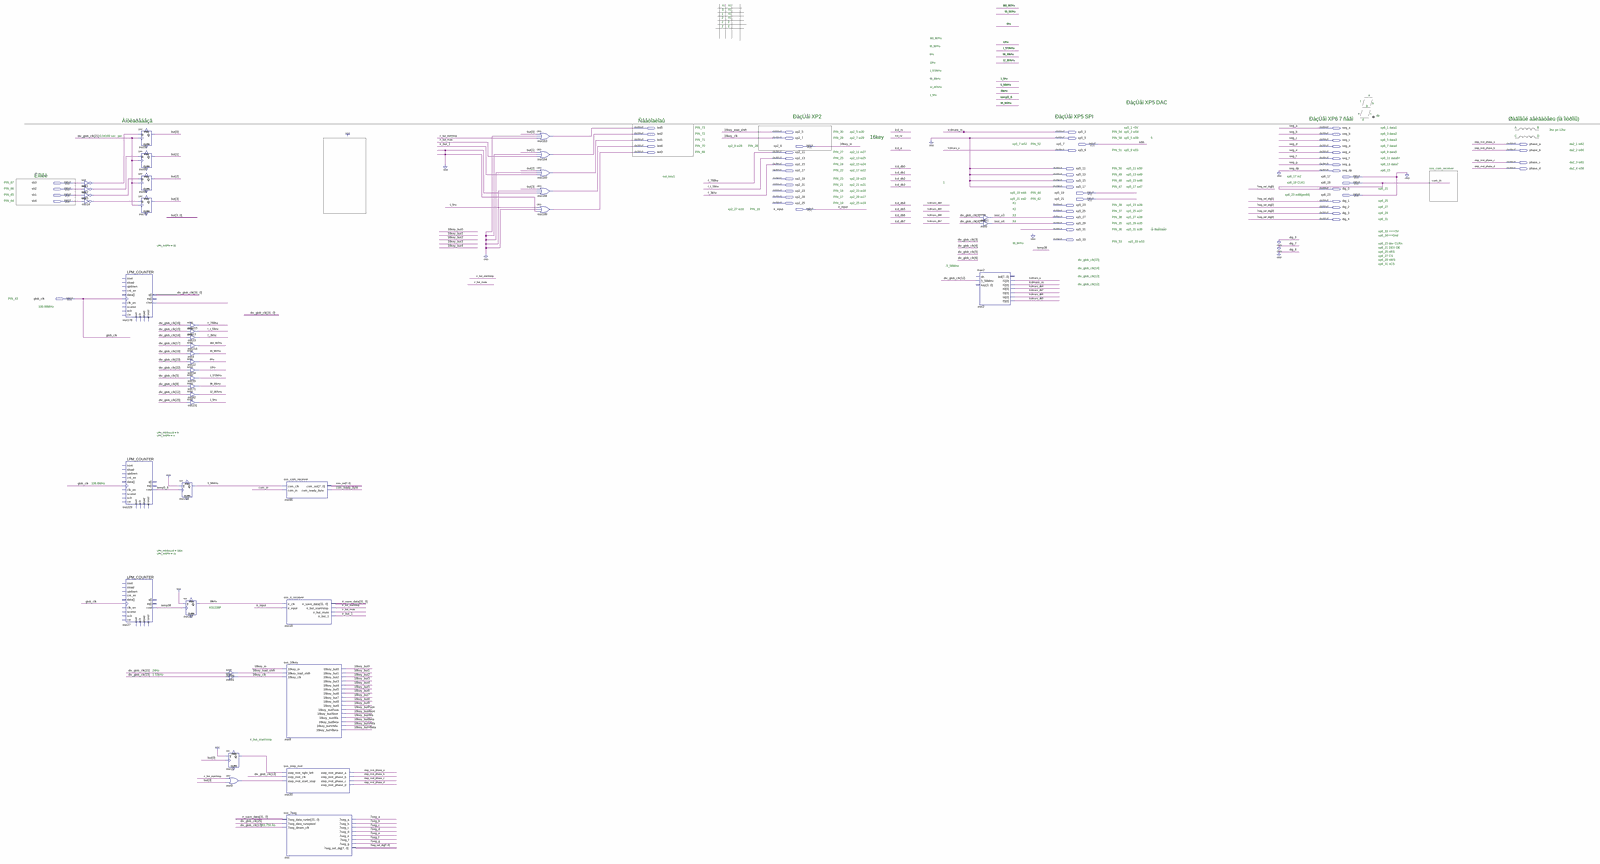
[diagram p0: schematic sheet, whole]
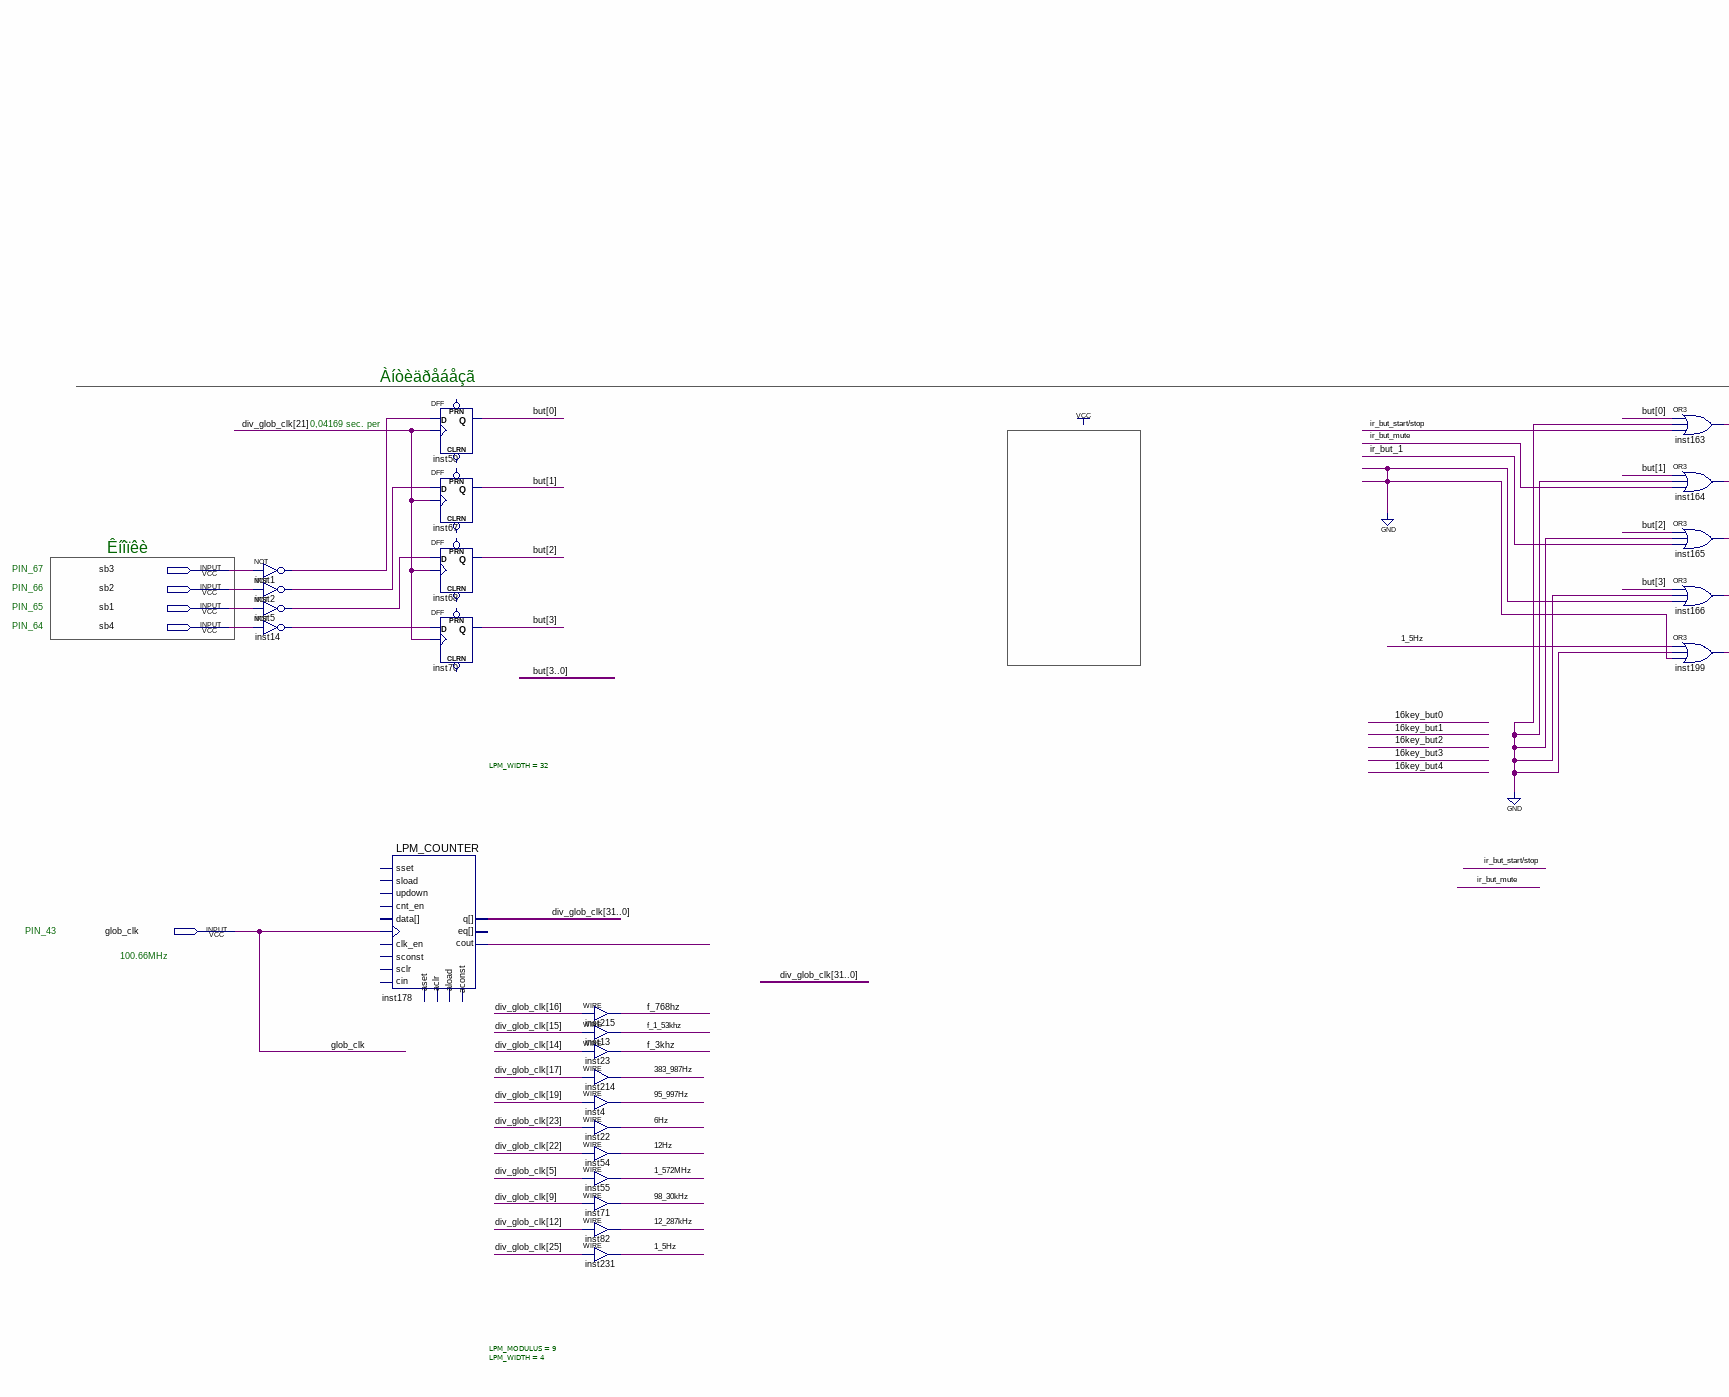
[diagram p1: schematic sheet, upper left part]
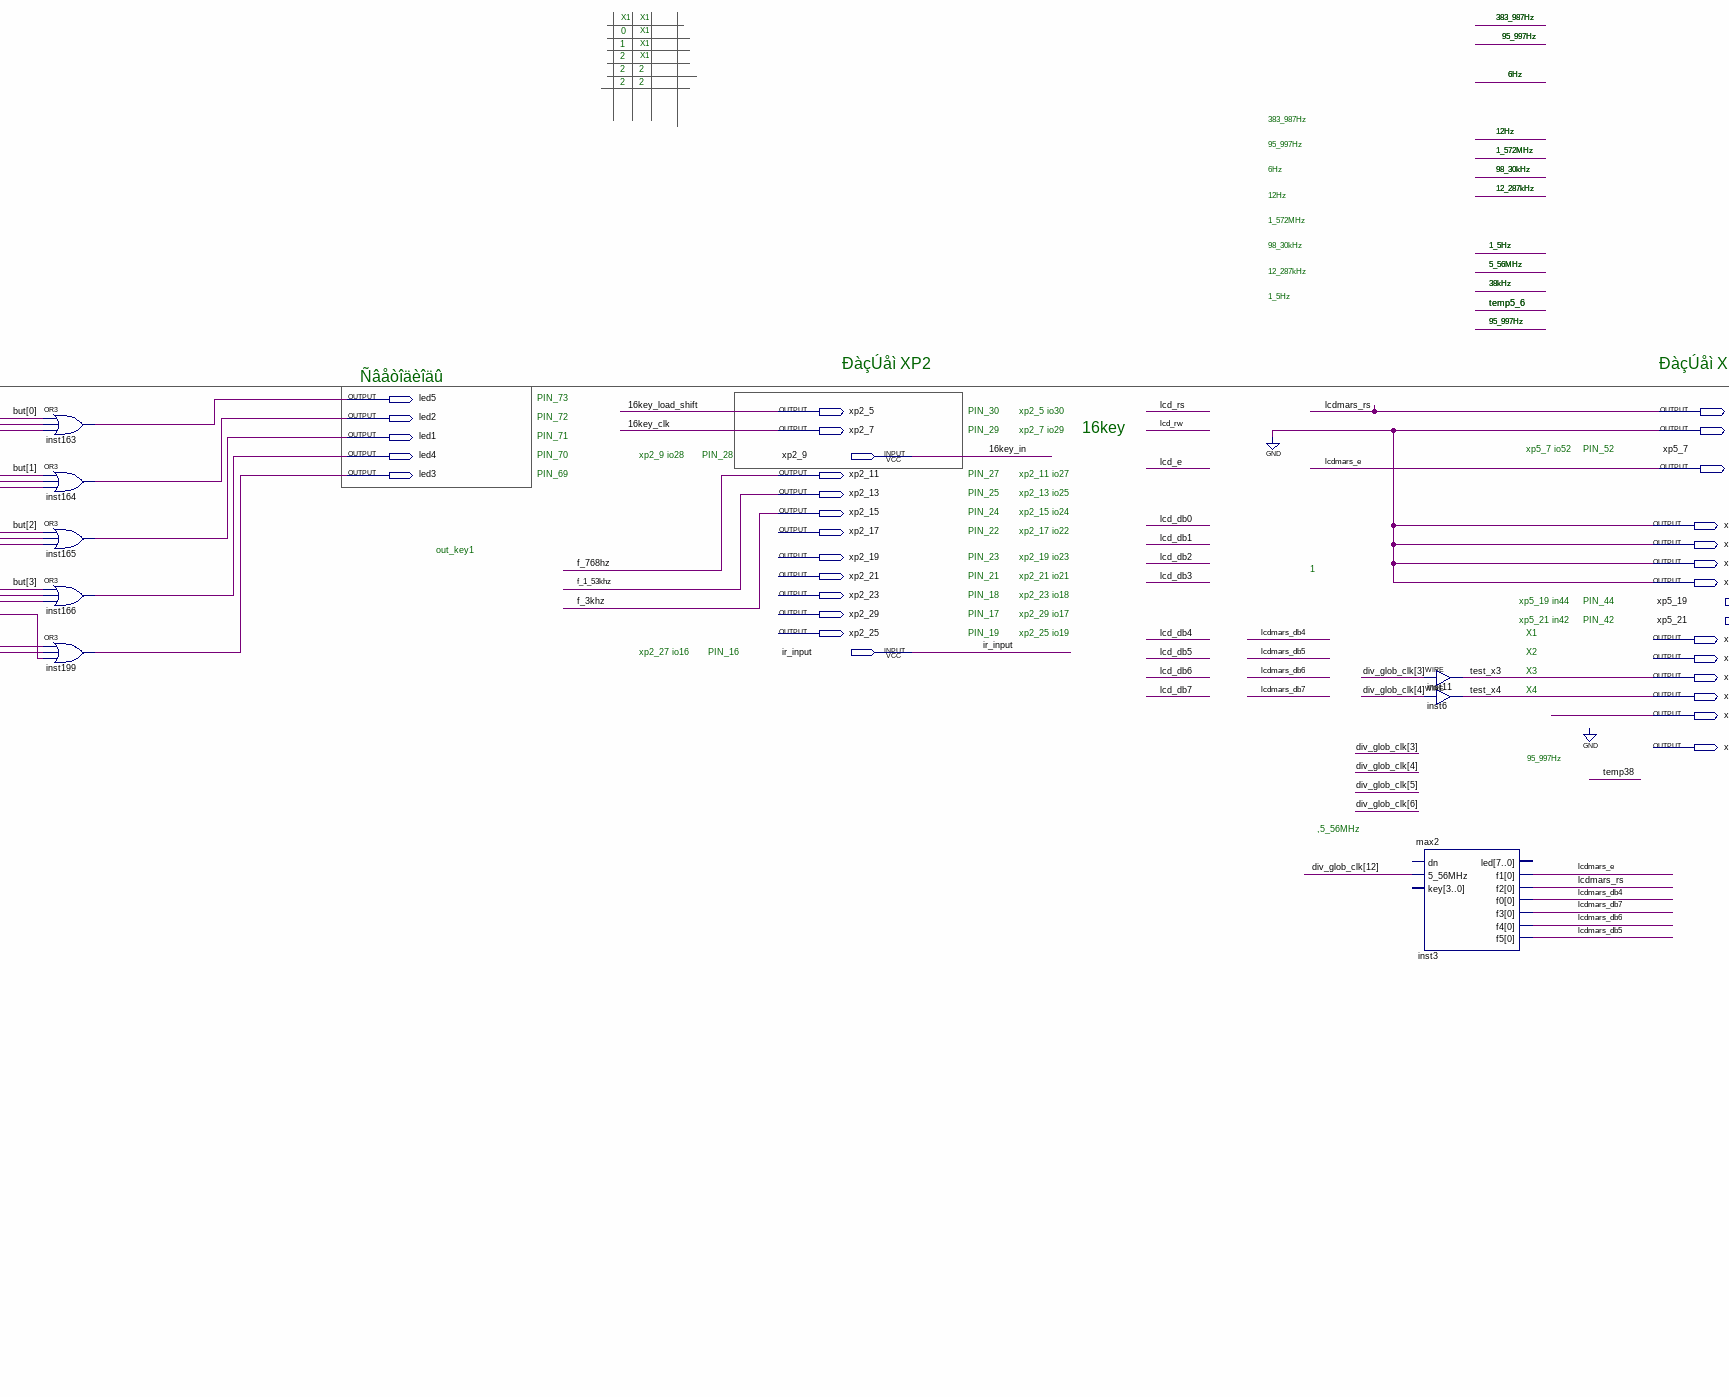
[diagram p2: schematic sheet, upper centre part]
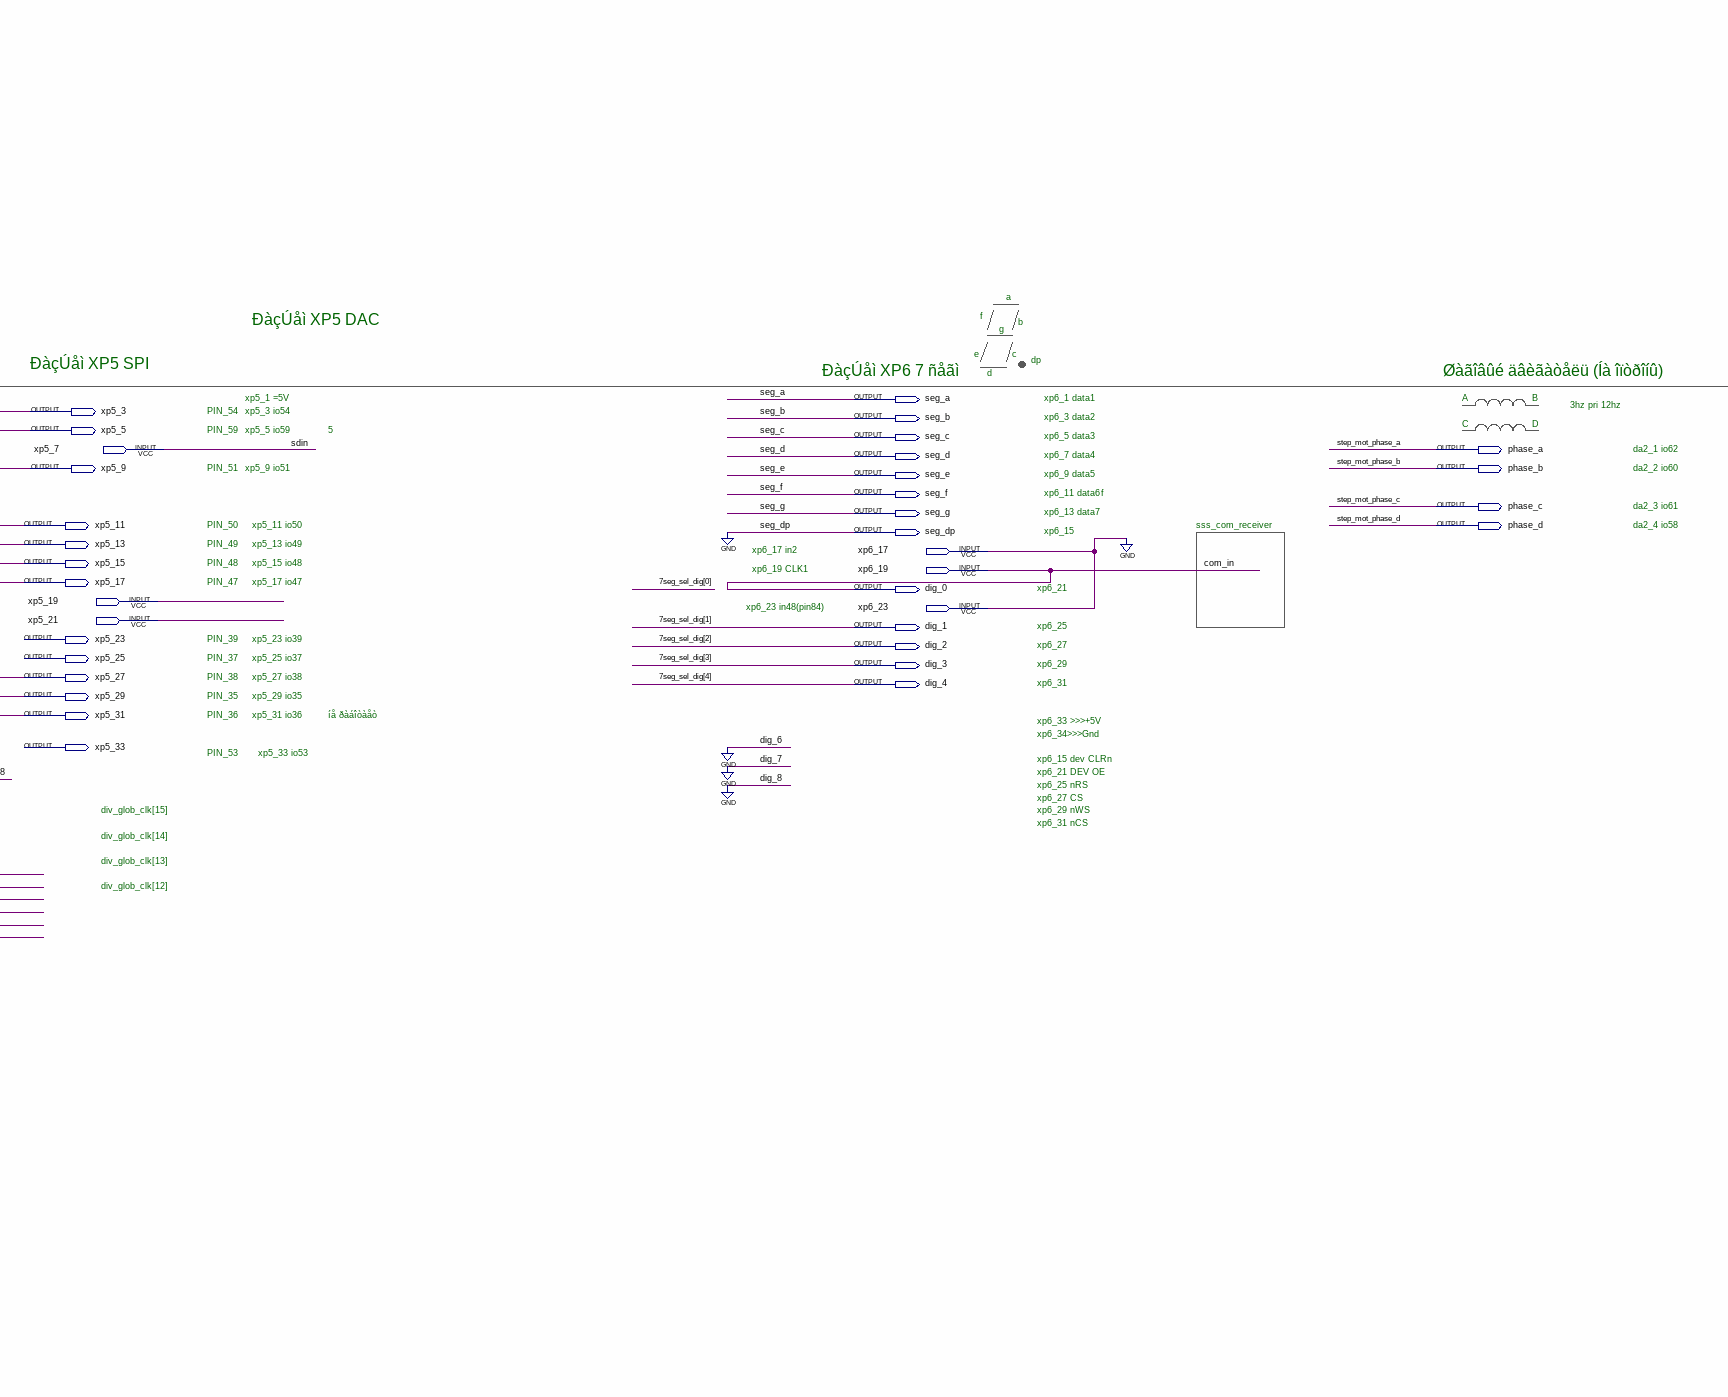
[diagram p3: schematic sheet, upper right part]
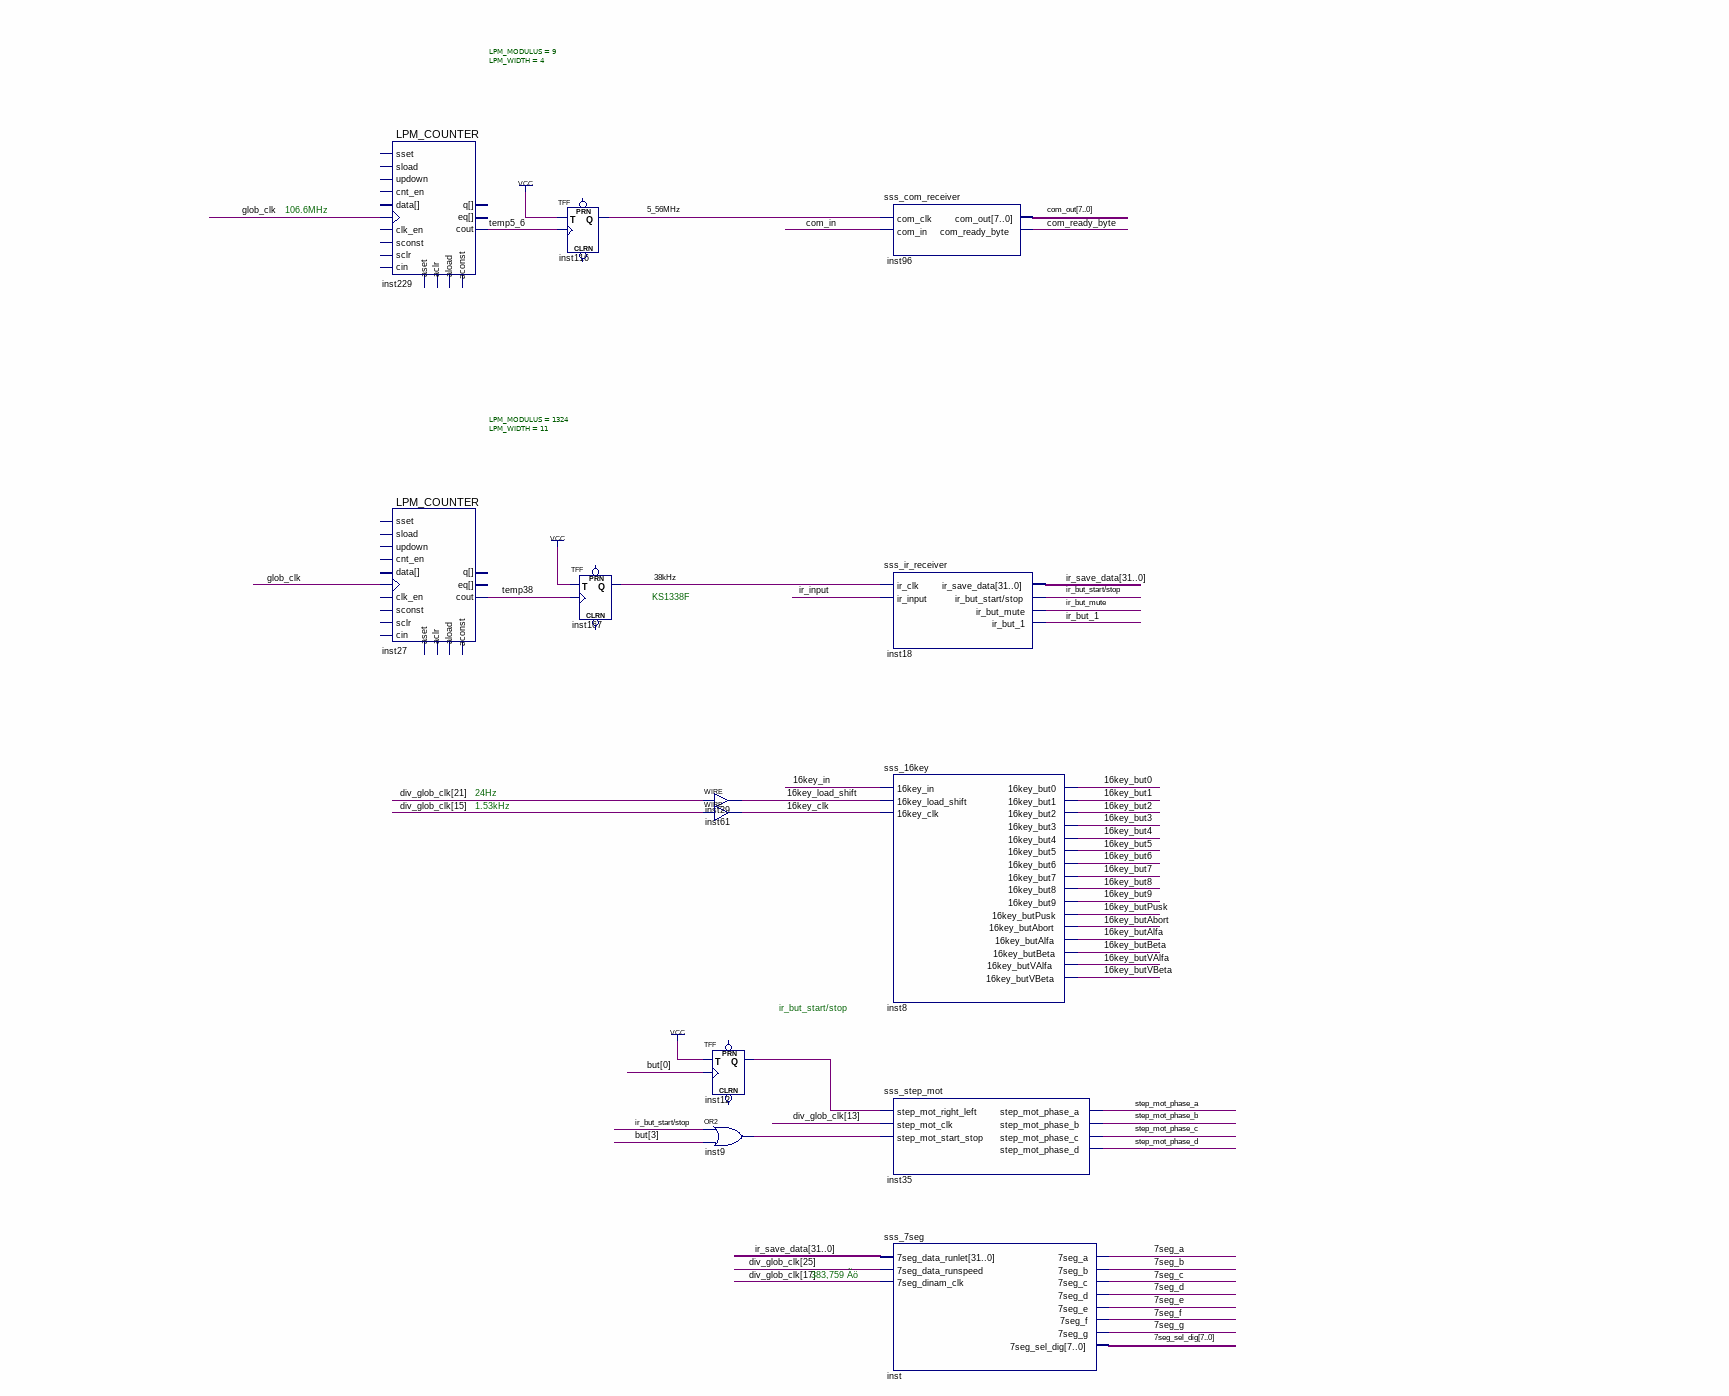
[diagram p4: schematic sheet, lower left part]
// Quartus schematic BRDepf10k10l.bdf as structural Verilog: 41 symbols, 59 pins
module BRDepf10k10l (
  input  xp5_7,
  input  xp2_9,
  input  xp6_17,
  input  sb3,
  input  xp6_19,
  input  sb2,
  input  xp5_19,
  input  sb1,
  input  xp6_23,
  input  xp5_21,
  input  sb4,
  input  ir_input,
  input  glob_clk,
  output led5,
  output seg_a,
  output xp2_5,
  output xp5_3,
  output led2,
  output seg_b,
  output xp2_7,
  output xp5_5,
  output led1,
  output seg_c,
  output phase_a,
  output led4,
  output seg_d,
  output xp5_9,
  output phase_b,
  output led3,
  output xp2_11,
  output seg_e,
  output xp2_13,
  output seg_f,
  output phase_c,
  output xp2_15,
  output seg_g,
  output xp5_11,
  output phase_d,
  output xp2_17,
  output seg_dp,
  output xp5_13,
  output xp2_19,
  output xp5_15,
  output xp2_21,
  output xp5_17,
  output dig_0,
  output xp2_23,
  output xp2_29,
  output dig_1,
  output xp2_25,
  output xp5_23,
  output dig_2,
  output xp5_25,
  output dig_3,
  output xp5_27,
  output dig_4,
  output xp5_29,
  output xp5_31,
  output xp5_33
);

  wire \1_5Hz , \1_572MHz , \5_56MHz , \6Hz , \7seg_a , \7seg_b , \7seg_c , \7seg_d , \7seg_e , \7seg_f ,
       \7seg_g , \12_287kHz , \12Hz , \16key_but0 , \16key_but1 , \16key_but2 , \16key_but3 , \16key_but4 ,
       \16key_but5 , \16key_but6 , \16key_but7 , \16key_but8 , \16key_but9 , \16key_butAbort ,
       \16key_butAlfa , \16key_butBeta , \16key_butPusk , \16key_butVAlfa , \16key_butVBeta , \38kHz ,
       \95_997Hz , \98_30kHz , \383_987Hz , com_ready_byte, inst1_out, inst2_out, inst5_out, inst9_out,
       inst12_q, inst14_out, inst178_cout, ir_but_1, ir_but_mute, \ir_but_start/stop , lcdmars_db4,
       lcdmars_db5, lcdmars_db6, lcdmars_db7, temp5_6, temp38;
  wire [3:0] but;
  wire [7:0] \7seg_sel_dig , com_out;
  wire [31:0] div_glob_clk, ir_save_data;

  not inst1 (inst1_out, sb3);
  not inst2 (inst2_out, sb2);
  not inst5 (inst5_out, sb1);
  not inst14 (inst14_out, sb4);
  LPM_COUNTER #(.LPM_WIDTH(32)) inst178 (
    .clock(glob_clk), .q(div_glob_clk), .cout(inst178_cout));  // open: sset, sload, updown, cnt_en, data, clk_en, sconst, sclr, aload, aclr, aset, aconst, cin, eq
  LPM_COUNTER #(.LPM_MODULUS(9), .LPM_WIDTH(4)) inst229 (
    .clock(glob_clk), .cout(temp5_6));  // open: sset, sload, updown, cnt_en, data, clk_en, sconst, sclr, aload, aclr, aset, aconst, cin, q, eq
  LPM_COUNTER #(.LPM_MODULUS(1324), .LPM_WIDTH(11)) inst27 (
    .clock(glob_clk), .cout(temp38));  // open: sset, sload, updown, cnt_en, data, clk_en, sconst, sclr, aload, aclr, aset, aconst, cin, q, eq
  DFF inst50 (.CLK(div_glob_clk[21]), .D(inst1_out), .Q(but[0]));  // open: CLRN, PRN
  DFF inst67 (.CLK(div_glob_clk[21]), .D(inst2_out), .Q(but[1]));  // open: CLRN, PRN
  DFF inst68 (.CLK(div_glob_clk[21]), .D(inst5_out), .Q(but[2]));  // open: CLRN, PRN
  DFF inst70 (.CLK(div_glob_clk[21]), .D(inst14_out), .Q(but[3]));  // open: CLRN, PRN
  assign xp2_11 = div_glob_clk[16];  // WIRE inst215
  assign xp2_13 = div_glob_clk[15];  // WIRE inst13
  assign xp2_15 = div_glob_clk[14];  // WIRE inst23
  assign \383_987Hz  = div_glob_clk[17];  // WIRE inst214
  assign \95_997Hz  = div_glob_clk[19];  // WIRE inst4
  assign \6Hz  = div_glob_clk[23];  // WIRE inst22
  assign \12Hz  = div_glob_clk[22];  // WIRE inst54
  assign \1_572MHz  = div_glob_clk[5];  // WIRE inst55
  assign \98_30kHz  = div_glob_clk[9];  // WIRE inst71
  assign \12_287kHz  = div_glob_clk[12];  // WIRE inst82
  assign \1_5Hz  = div_glob_clk[25];  // WIRE inst231
  TFF inst116 (.T(1'b1), .CLK(temp5_6), .Q(\5_56MHz ));  // open: PRN, CLRN
  TFF inst167 (.T(1'b1), .CLK(temp38), .Q(\38kHz ));  // open: PRN, CLRN
  assign xp2_5 = div_glob_clk[21];  // WIRE inst29
  assign xp2_7 = div_glob_clk[15];  // WIRE inst61
  TFF inst12 (.T(1'b1), .CLK(but[0]), .Q(inst12_q));  // open: PRN, CLRN
  or inst9 (inst9_out, \ir_but_start/stop , but[3]);
  sss_com_receiver inst96 (.com_clk(\5_56MHz ), .com_in(xp6_19), .com_out(com_out), .com_ready_byte(com_ready_byte));
  sss_ir_receiver inst18 (
    .ir_clk(\38kHz ), .ir_input(ir_input), .ir_save_data(ir_save_data),
    .\ir_but_start/stop (\ir_but_start/stop ), .ir_but_mute(ir_but_mute), .ir_but_1(ir_but_1));
  sss_16key inst8 (
    .\16key_in (xp2_9), .\16key_load_shift (xp2_5), .\16key_clk (xp2_7), .\16key_but0 (\16key_but0 ),
    .\16key_but1 (\16key_but1 ), .\16key_but2 (\16key_but2 ), .\16key_but3 (\16key_but3 ),
    .\16key_but4 (\16key_but4 ), .\16key_but5 (\16key_but5 ), .\16key_but6 (\16key_but6 ),
    .\16key_but7 (\16key_but7 ), .\16key_but8 (\16key_but8 ), .\16key_but9 (\16key_but9 ),
    .\16key_butPusk (\16key_butPusk ), .\16key_butAbort (\16key_butAbort ),
    .\16key_butAlfa (\16key_butAlfa ), .\16key_butBeta (\16key_butBeta ),
    .\16key_butVAlfa (\16key_butVAlfa ), .\16key_butVBeta (\16key_butVBeta ));
  sss_step_mot inst35 (
    .step_mot_right_left(inst12_q), .step_mot_clk(div_glob_clk[13]), .step_mot_start_stop(inst9_out),
    .step_mot_phase_a(phase_a), .step_mot_phase_b(phase_b), .step_mot_phase_c(phase_c),
    .step_mot_phase_d(phase_d));
  sss_7seg inst (
    .\7seg_data_runlet (ir_save_data), .\7seg_data_runspeed (div_glob_clk[25]),
    .\7seg_dinam_clk (div_glob_clk[17]), .\7seg_a (\7seg_a ), .\7seg_b (\7seg_b ), .\7seg_c (\7seg_c ),
    .\7seg_d (\7seg_d ), .\7seg_e (\7seg_e ), .\7seg_f (\7seg_f ), .\7seg_g (\7seg_g ),
    .\7seg_sel_dig ({\7seg_sel_dig [7:5], dig_4, dig_3, dig_2, dig_1, \7seg_sel_dig [0]}));
  or inst163 (led5, but[0], 1'b0, \ir_but_start/stop );
  or inst164 (led2, but[1], 1'b0, ir_but_mute);
  or inst165 (led1, but[2], 1'b0, ir_but_1);
  or inst166 (led4, but[3], 1'b0, 1'b0);
  or inst199 (led3, \1_5Hz , 1'b0, 1'b0);
  assign xp5_27 = div_glob_clk[3];  // WIRE inst11
  assign xp5_29 = div_glob_clk[4];  // WIRE inst6
  max2 inst3 (
    .\5_56MHz (div_glob_clk[12]), .f1(xp5_9), .f2(xp5_3), .f0(lcdmars_db4), .f3(lcdmars_db7),
    .f4(lcdmars_db6), .f5(lcdmars_db5));  // open: dn, key, led

  assign dig_0 = xp6_19;
  assign seg_dp = 1'b0;
  assign xp5_5 = 1'b0;
  assign xp5_11 = 1'b0;
  assign xp5_13 = 1'b0;
  assign xp5_15 = 1'b0;
  assign xp5_17 = 1'b0;
  assign xp6_23 = xp6_17;
  // also tied to GND on the sheet: xp6_17

  // Other names for the same wires on the sheet: 7seg_sel_dig[4:1] = {dig_4, dig_3, dig_2, dig_1}; 16key_clk = xp2_7;
  //   16key_in = xp2_9; 16key_load_shift = xp2_5; com_in = xp6_19; lcdmars_e = xp5_9; lcdmars_rs = xp5_3;
  //   sdin = xp5_7; step_mot_phase_a = phase_a; step_mot_phase_b = phase_b; step_mot_phase_c = phase_c;
  //   step_mot_phase_d = phase_d; test_x3 = xp5_27; test_x4 = xp5_29; f_768hz = xp2_11; f_1_53khz = xp2_13;
  //   f_3khz = xp2_15

  // Notes on the sheet:
  //   X1
  //   X1
  //   383_987Hz
  //   0
  //   X1
  //   95_997Hz
  //   1
  //   X1
  //   2
  //   X1
  //   2
  //   2
  //   6Hz
  //   2
  //   2
  //   383_987Hz
  //   12Hz
  //   95_997Hz
  //   1_572MHz
  //   6Hz
  //   98_30kHz
  //   12_287kHz
  //   12Hz
  //   1_572MHz
  //   98_30kHz
  //   1_5Hz
  //   5_56MHz
  //   12_287kHz
  //   38kHz
  //   1_5Hz
  //   a
  //   temp5_6
  //   ÐàçÚåì XP5 DAC
  //   f
  //   95_997Hz
  //   b
  //   g
  //   e
  //   c
  //   ÐàçÚåì XP2
  //   ÐàçÚåì XP5 SPI
  //   dp
  //   ÐàçÚåì XP6 7 ñåãì
  //   Øàãîâûé äâèãàòåëü (Íà îïòðîíû)
  //   Àíòèäðåáåçã
  //   Ñâåòîäèîäû
  //   d
  //   PIN_73
  //   xp5_1 =5V
  //   xp6_1 data1
  //   A
  //   B
  //   3hz pri 12hz
  //   PIN_30
  //   xp2_5 io30
  //   PIN_54
  //   xp5_3 io54
  //   PIN_72
  //   xp6_3 data2
  //   0,04169 sec. per
  //   16key
  //   C
  //   D
  //   PIN_29
  //   xp2_7 io29
  //   PIN_59
  //   xp5_5 io59
  //   5
  //   PIN_71
  //   xp6_5 data3
  //   xp5_7 io52
  //   PIN_52
  //   da2_1 io62
  //   PIN_70
  //   xp2_9 io28
  //   PIN_28
  //   xp6_7 data4
  //   PIN_51
  //   xp5_9 io51
  //   da2_2 io60
  //   PIN_69
  //   PIN_27
  //   xp2_11 io27
  //   xp6_9 data5
  //   PIN_25
  //   xp2_13 io25
  //   xp6_11 data6
  //   f
  //   da2_3 io61
  //   PIN_24
  //   xp2_15 io24
  //   xp6_13 data7
  //   PIN_50
  //   xp5_11 io50
  //   sss_com_receiver
  //   da2_4 io58
  //   PIN_22
  //   xp2_17 io22
  //   xp6_15
  //   Êíîïêè
  //   PIN_49
  //   xp5_13 io49
  //   out_key1
  //   xp6_17 in2
  //   PIN_23
  //   xp2_19 io23
  //   PIN_48
  //   xp5_15 io48
  //   PIN_67
  //   1
  //   xp6_19 CLK1
  //   PIN_21
  //   xp2_21 io21
  //   PIN_47
  //   xp5_17 io47
  //   PIN_66
  //   xp6_21
  //   PIN_18
  //   xp2_23 io18
  //   xp5_19 in44
  //   PIN_44
  //   PIN_65
  //   xp6_23 in48(pin84)
  //   PIN_17
  //   xp2_29 io17
  //   xp5_21 in42
  //   PIN_42
  //   PIN_64
  //   xp6_25
  //   PIN_19
  //   xp2_25 io19
  //   X1
  //   PIN_39
  //   xp5_23 io39
  //   xp6_27
  //   xp2_27 io16
  //   PIN_16
  //   X2
  //   PIN_37
  //   xp5_25 io37
  //   xp6_29
  //   X3
  //   PIN_38
  //   xp5_27 io38
  //   xp6_31
  //   X4
  //   PIN_35
  //   xp5_29 io35
  //   PIN_36
  //   xp5_31 io36
  //   íå ðàáîòàåò
  //   xp6_33 >>>+5V
  //   xp6_34>>>Gnd
  //   PIN_53
  //   xp5_33 io53
  //   95_997Hz
  //   xp6_15 dev CLRn
  //   xp6_21 DEV OE
  //   xp6_25 nRS
  //   xp6_27 CS
  //   div_glob_clk[15]
  //   xp6_29 nWS
  //   xp6_31 nCS
  //   ,5_56MHz
  //   div_glob_clk[14]
  //   div_glob_clk[13]
  //   div_glob_clk[12]
  //   PIN_43
  //   100.66MHz
  //   106.6MHz
  //   KS1338F
  //   24Hz
  //   1.53kHz
  //   ir_but_start/stop
  //   383,759 Ãö
endmodule
